# Altium schematic sheet S2C_IOs3V3_SelectSPI.SchDoc
size A4; SheetNumber: 13
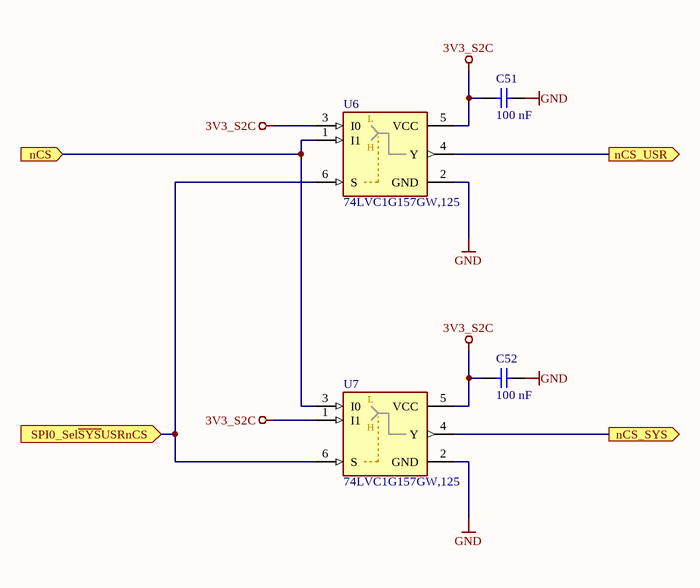
[diagram p0: S2C_IOs3V3_SelectSPI.SchDoc]

## Parts
C51  100 nF  [C_0603_TE]
C52  100 nF  [C_0603_TE]
U6  74LVC1G157GW,125  [SOT-363]
U7  74LVC1G157GW,125  [SOT-363]

## Ports
nCS (in), nCS_SYS (out), nCS_USR (out), SPI0_Sel~{SYS}USRnCS (in)

## Nets
3V3_S2C: C51.2 C52.2 U6.3(I0) U6.5(VCC) U7.1(I1) U7.5(VCC)
GND: C51.1 C52.1 U6.2(GND) U7.2(GND)
nCS: U6.1(I1) U7.3(I0) ; port nCS
nCS_SYS: U7.4(Y) ; port nCS_SYS
nCS_USR: U6.4(Y) ; port nCS_USR
SPI0_Sel~{SYS}USRnCS: U6.6(S) U7.6(S) ; port SPI0_Sel~{SYS}USRnCS

## Notes on the sheet
- Title
- Revision:
- Design Engineer:
- Date:
- Project:
- Sheet
- of
- (in symbol 74LVC1G157GW,125) L; H

## Library data of the parts
C51 C52 = UZgen_C_0603_100nF_50V_X7R: Generic capacitor; Manufacturer: UZgen; Voltage: 50V; Tolerance: 10 %; Created from: AGeiger; Manufacturer Part Number: UZgen_C_0603_100nF_50V_X7R; PartID: 1; Created On: 02/07/2024 14:42:23; Value: 100 nF; Device Package: 0603; Technology: X7R; Mounting Type: SMD; Last Updated: 08/08/2024 15:01:15
U6 U7 = 74LVC1G157GW,125: Single 2-input multiplexer; Manufacturer: Nexperia; Created from: MGeier; Manufacturer Part Number: 74LVC1G157GW,125; PartID: 21; Created On: 11/03/2025 22:40:00; ComponentLink1Description: Datasheet; ComponentLink1URL: https://assets.nexperia.com/documents/data-sheet/74LVC1G157.pdf; Component Type: Multiplexer; Device Package: TSSOP-6; Last Updated: 11/03/2025 22:40:00; Mounting Type: SMD; Operating Temperature: -40 - +125 °C; Supplier 1: LCSC; Supplier Part Number 1: C135822; Type: Multiplexer; Live Cycle Status: 1; LCSC Part Number: C135822